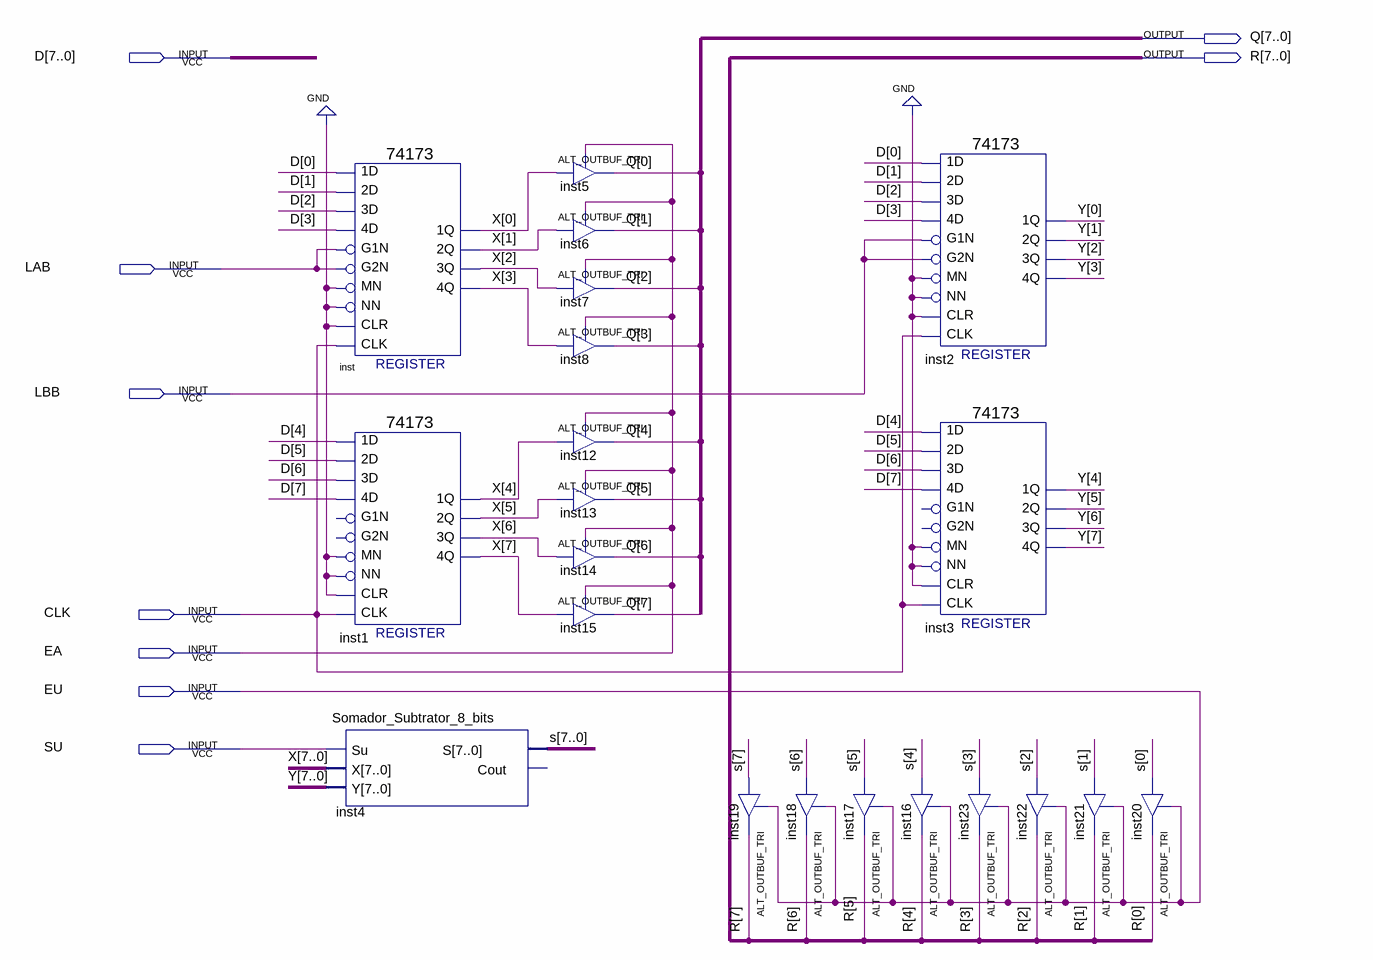
[diagram p0: schematic sheet]
// Quartus schematic ULA.bdf as structural Verilog: 21 symbols, 9 pins
module ULA (
  input  [7:0] D,
  input  LAB,
  input  LBB,
  input  CLK,
  input  EA,
  input  EU,
  input  SU,
  output [7:0] Q,
  output [7:0] R
);

  wire [7:0] s, X, Y;

  \74173  inst (
    .\3D (D[2]), .MN(1'b0), .\1D (D[0]), .\2D (D[1]), .\4D (D[3]), .G1N(LAB), .G2N(LAB), .NN(1'b0),
    .CLR(1'b0), .CLK(CLK), .\3Q (X[2]), .\2Q (X[1]), .\1Q (X[0]), .\4Q (X[3]));
  \74173  inst1 (
    .\3D (D[6]), .MN(1'b0), .\1D (D[4]), .\2D (D[5]), .\4D (D[7]), .NN(1'b0), .CLR(1'b0), .CLK(CLK),
    .\3Q (X[6]), .\2Q (X[5]), .\1Q (X[4]), .\4Q (X[7]));  // open: G1N, G2N
  Somador_Subtrator_8_bits inst4 (.Su(SU), .X(X), .Y(Y), .S(s));  // open: Cout
  ALT_OUTBUF_TRI inst5 (.i(X[0]), .oe(EA), .o(Q[0]));
  ALT_OUTBUF_TRI inst6 (.i(X[1]), .oe(EA), .o(Q[1]));
  ALT_OUTBUF_TRI inst7 (.i(X[2]), .oe(EA), .o(Q[2]));
  ALT_OUTBUF_TRI inst8 (.i(X[3]), .oe(EA), .o(Q[3]));
  ALT_OUTBUF_TRI inst12 (.i(X[4]), .oe(EA), .o(Q[4]));
  ALT_OUTBUF_TRI inst13 (.i(X[5]), .oe(EA), .o(Q[5]));
  ALT_OUTBUF_TRI inst14 (.i(X[6]), .oe(EA), .o(Q[6]));
  ALT_OUTBUF_TRI inst15 (.i(X[7]), .oe(EA), .o(Q[7]));
  ALT_OUTBUF_TRI inst19 (.i(s[7]), .oe(EU), .o(R[7]));
  ALT_OUTBUF_TRI inst17 (.i(s[5]), .oe(EU), .o(R[5]));
  ALT_OUTBUF_TRI inst18 (.i(s[6]), .oe(EU), .o(R[6]));
  \74173  inst2 (
    .\3D (D[2]), .MN(1'b0), .\1D (D[0]), .\2D (D[1]), .\4D (D[3]), .G1N(LBB), .G2N(LBB), .NN(1'b0),
    .CLR(1'b0), .CLK(CLK), .\3Q (Y[2]), .\2Q (Y[1]), .\1Q (Y[0]), .\4Q (Y[3]));
  \74173  inst3 (
    .\3D (D[6]), .MN(1'b0), .\1D (D[4]), .\2D (D[5]), .\4D (D[7]), .NN(1'b0), .CLR(1'b0), .CLK(CLK),
    .\3Q (Y[6]), .\2Q (Y[5]), .\1Q (Y[4]), .\4Q (Y[7]));  // open: G1N, G2N
  ALT_OUTBUF_TRI inst16 (.i(s[4]), .oe(EU), .o(R[4]));
  ALT_OUTBUF_TRI inst23 (.i(s[3]), .oe(EU), .o(R[3]));
  ALT_OUTBUF_TRI inst21 (.i(s[1]), .oe(EU), .o(R[1]));
  ALT_OUTBUF_TRI inst22 (.i(s[2]), .oe(EU), .o(R[2]));
  ALT_OUTBUF_TRI inst20 (.i(s[0]), .oe(EU), .o(R[0]));
endmodule
